# Altium project VE373.PrjPcb
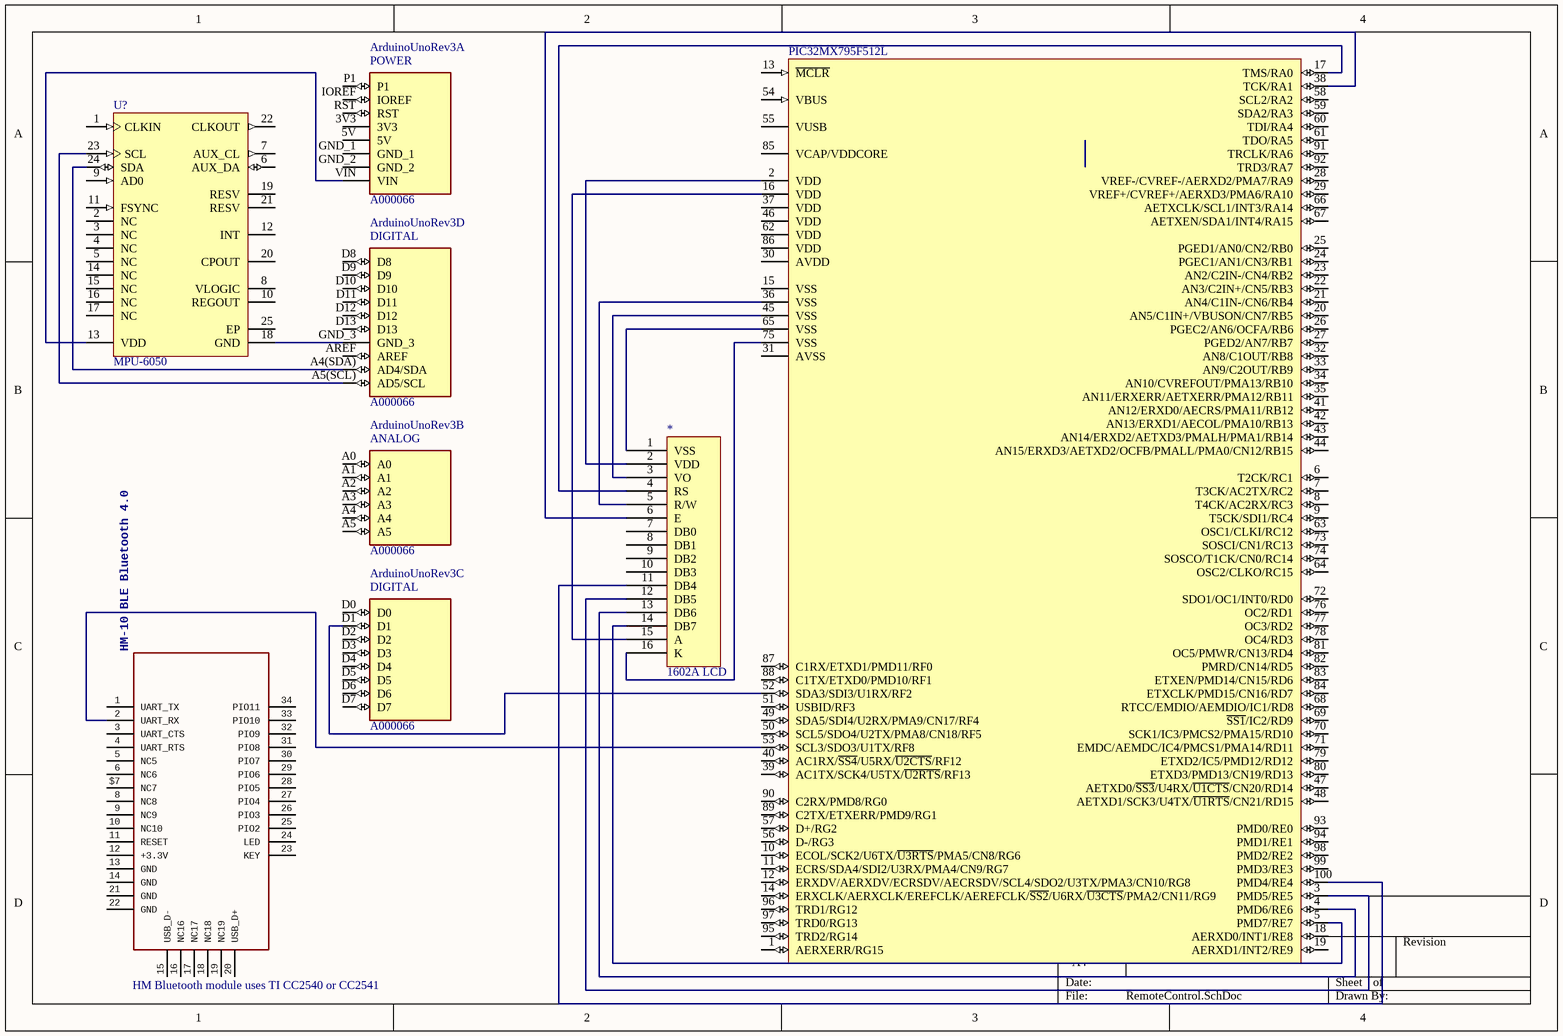
[diagram p0: RemoteControl.SchDoc]
1 sheet, 5 parts. Net scope: global (net labels, ports and power ports of the same name join across sheets).

## Sheet RemoteControl.SchDoc
size A4; SheetNumber: 1; SheetTotal: 1

### Parts
*  1602A LCD
ArduinoUnoRev3  A000066  [ARDUINO_A000066]  (parts A,B,C,D of 4)
HM-10_BLE_Bluetooth_4.0  HM Bluetooth module uses TI CC2540 or CC2541  [26.9X13X2.2_BOARD]
PIC32MX795F512L  PIC32MX795F512L-80I/PT  [TQFP-PT100_N]  (value not drawn)
U?  MPU-6050  [IS-QFN-24_V]

### Nets
Net*_1: *.1(VSS) PIC32MX795F512L.65(VSS)
Net*_2: *.2(VDD) PIC32MX795F512L.2(VDD)
Net*_3: *.3(VO) PIC32MX795F512L.45(VSS)
Net*_4: *.4(RS) PIC32MX795F512L.17(TMS/RA0)
Net*_5: *.5(R/W) PIC32MX795F512L.36(VSS)
Net*_6: *.6(E) PIC32MX795F512L.38(TCK/RA1)
Net*_11: *.11(DB4) PIC32MX795F512L.100(PMD4/RE4)
Net*_12: *.12(DB5) PIC32MX795F512L.3(PMD5/RE5)
Net*_13: *.13(DB6) PIC32MX795F512L.4(PMD6/RE6)
Net*_14: *.14(DB7) PIC32MX795F512L.5(PMD7/RE7)
Net*_15: *.15(A) PIC32MX795F512L.16(VDD)
Net*_16: *.16(K) PIC32MX795F512L.75(VSS)
NetArduinoUnoRev3_A4(SDA): ArduinoUnoRev3.A4(SDA)(AD4/SDA) U?.24(SDA)
NetArduinoUnoRev3_A5(SCL): ArduinoUnoRev3.A5(SCL)(AD5/SCL) U?.23(SCL)
NetArduinoUnoRev3_D1: ArduinoUnoRev3.D1 PIC32MX795F512L.52(SDA3/SDI3/U1RX/RF2)
NetArduinoUnoRev3_GND_3: ArduinoUnoRev3.GND_3 U?.18(GND)
NetArduinoUnoRev3_VIN: ArduinoUnoRev3.VIN U?.13(VDD)
NetHM-10_BLE_Bluetooth_4.0_2: HM-10_BLE_Bluetooth_4.0.2(UART_RX) PIC32MX795F512L.53(SCL3/SDO3/U1TX/RF8)

Not connected (* = marked no-connect by the designer): * 7(DB0) 8(DB1) 9(DB2) 10(DB3); ArduinoUnoRev3 3V3 5V A0 A1 A2 A3 A4 A5 AREF D0 D2 D3 D4 D5 D6 D7 D8 D9 D10 D11 D12 D13 GND_1 GND_2 IOREF P1 RST; HM-10_BLE_Bluetooth_4.0 1(UART_TX) 3(UART_CTS) 4(UART_RTS) 5(NC5) 6(NC6) 8(NC8) 9(NC9) 10(NC10) 11(RESET) 12(+3.3V) 13(GND) 14(GND) 15(USB_D-) 16(NC16) 17(NC17) 18(NC18) 19(NC19) 20(USB_D+) 21(GND) 22(GND) 23(KEY) 24(LED) 25(PIO2) 26(PIO3) 27(PIO4) 28(PIO5) 29(PIO6) 30(PIO7) 31(PIO8) 32(PIO9) 33(PIO10) 34(PIO11) $7(NC7); PIC32MX795F512L 1(AERXERR/RG15) 6(T2CK/RC1) 7(T3CK/AC2TX/RC2) 8(T4CK/AC2RX/RC3) 9(T5CK/SDI1/RC4) 10(ECOL/SCK2/U6TX/~{U3RTS}/PMA5/CN8/RG6) 11(ECRS/SDA4/SDI2/U3RX/PMA4/CN9/RG7) 12(ERXDV/AERXDV/ECRSDV/AECRSDV/SCL4/SDO2/U3TX/PMA3/CN10/RG8) 13(~{MCLR}) 14(ERXCLK/AERXCLK/EREFCLK/AEREFCLK/~{SS2}/U6RX/~{U3CTS}/PMA2/CN11/RG9) 15(VSS) 18(AERXD0/INT1/RE8) 19(AERXD1/INT2/RE9) 20(AN5/C1IN+/VBUSON/CN7/RB5) 21(AN4/C1IN-/CN6/RB4) 22(AN3/C2IN+/CN5/RB3) 23(AN2/C2IN-/CN4/RB2) 24(PGEC1/AN1/CN3/RB1) 25(PGED1/AN0/CN2/RB0) 26(PGEC2/AN6/OCFA/RB6) 27(PGED2/AN7/RB7) 28(VREF-/CVREF-/AERXD2/PMA7/RA9) 29(VREF+/CVREF+/AERXD3/PMA6/RA10) 30(AVDD) 31(AVSS) 32(AN8/C1OUT/RB8) 33(AN9/C2OUT/RB9) 34(AN10/CVREFOUT/PMA13/RB10) 35(AN11/ERXERR/AETXERR/PMA12/RB11) 37(VDD) 39(AC1TX/SCK4/U5TX/~{U2RTS}/RF13) 40(AC1RX/~{SS4}/U5RX/~{U2CTS}/RF12) 41(AN12/ERXD0/AECRS/PMA11/RB12) 42(AN13/ERXD1/AECOL/PMA10/RB13) 43(AN14/ERXD2/AETXD3/PMALH/PMA1/RB14) 44(AN15/ERXD3/AETXD2/OCFB/PMALL/PMA0/CN12/RB15) 46(VDD) 47(AETXD0/~{SS3}/U4RX/~{U1CTS}/CN20/RD14) 48(AETXD1/SCK3/U4TX/~{U1RTS}/CN21/RD15) 49(SDA5/SDI4/U2RX/PMA9/CN17/RF4) 50(SCL5/SDO4/U2TX/PMA8/CN18/RF5) 51(USBID/RF3) 54(VBUS) 55(VUSB) 56(D-/RG3) 57(D+/RG2) 58(SCL2/RA2) 59(SDA2/RA3) 60(TDI/RA4) 61(TDO/RA5) 62(VDD) 63(OSC1/CLKI/RC12) 64(OSC2/CLKO/RC15) 66(AETXCLK/SCL1/INT3/RA14) 67(AETXEN/SDA1/INT4/RA15) 68(RTCC/EMDIO/AEMDIO/IC1/RD8) 69(~{SS1}/IC2/RD9) 70(SCK1/IC3/PMCS2/PMA15/RD10) 71(EMDC/AEMDC/IC4/PMCS1/PMA14/RD11) 72(SDO1/OC1/INT0/RD0) 73(SOSCI/CN1/RC13) 74(SOSCO/T1CK/CN0/RC14) 76(OC2/RD1) 77(OC3/RD2) 78(OC4/RD3) 79(ETXD2/IC5/PMD12/RD12) 80(ETXD3/PMD13/CN19/RD13) 81(OC5/PMWR/CN13/RD4) 82(PMRD/CN14/RD5) 83(ETXEN/PMD14/CN15/RD6) 84(ETXCLK/PMD15/CN16/RD7) 85(VCAP/VDDCORE) 86(VDD) 87(C1RX/ETXD1/PMD11/RF0) 88(C1TX/ETXD0/PMD10/RF1) 89(C2TX/ETXERR/PMD9/RG1) 90(C2RX/PMD8/RG0) 91(TRCLK/RA6) 92(TRD3/RA7) 93(PMD0/RE0) 94(PMD1/RE1) 95(TRD2/RG14) 96(TRD1/RG12) 97(TRD0/RG13) 98(PMD2/RE2) 99(PMD3/RE3); U? 1(CLKIN) 2(NC) 3(NC) 4(NC) 5(NC) 6(AUX_DA) 7(AUX_CL) 8(VLOGIC) 9(AD0) 10(REGOUT) 11(FSYNC) 12(INT) 14(NC) 15(NC) 16(NC) 17(NC) 19(RESV) 20(CPOUT) 21(RESV) 22(CLKOUT) 25(EP)

### Notes on the sheet
- (in symbol A000066, part A) POWER
- (in symbol A000066, part B) ANALOG
- (in symbol A000066, part C) DIGITAL
- (in symbol A000066, part D) DIGITAL

### Library data of the parts
ArduinoUnoRev3 = A000066: Plated Through Hole Protoboard Arduino Mega Platform Evaluation Expansion Board; pin to pad: A4(SDA)>A4(SDA; MP: ARDUINO UNO REV3; Value: *; MF: Arduino; Package: None; Price: None; SnapEDA_Link: https://www.snapeda.com/parts/ARDUINO%20UNO%20REV3/Arduino/view-part/1128320/?ref=snap; Availability: In Stock; Check_prices: https://www.snapeda.com/parts/ARDUINO%20UNO%20REV3/Arduino/view-part/1128320/?ref=eda
HM-10_BLE_Bluetooth_4.0 = HM-10-BOARD
PIC32MX795F512L = CMP-0048-00041-2: High Performance 80 MHz MIPS-Based 32-Bit Flash Microcontroller with USB, CAN and Ethernet, 512KB Program Memory, 100-pin TQFP, Industrial Temperature; PackageVersion: revBB, Aug-2009; RevisionNote: Component URLs added. DatasheetVersion updated. Pin names updated.; DatasheetVersion: revG, May-2011; PackageDescription: 100-Lead Plastic Thin Quad Flatpack (PT) - 12x12x1mm Body, 2.00mm [TQFP]; ComponentLink3Description: Microchip.com Home; ComponentLink3URL: http://www.microchip.com/; ComponentLink2Description: Packaging Specification; ComponentLink2URL: http://ww1.microchip.com/downloads/en/PackagingSpec/en012702.pdf; ComponentLink1URL: http://ww1.microchip.com/downloads/en/DeviceDoc/61156G.pdf; PackageReference: TQFP-PT100; ComponentLink1Description: Datasheet
U? = CMP-1753-00002-2: 3-Axis Gyroscope, Accelerometer and a Digital Motion Processor(TM) (DMP), 2.375 to 3.46 V, -40 to 85 degC, 24-Pin QFN, RoHS, Tape and Reel; Manufacturer: InvenSense; Featured Product: MPU-60506-Axis,IntegratedI²CSolution; Other Names: 1428-1007-2 / MPU6050; Sensor Type: MotionTracking; Online Catalog: MPU-6000™Series; Unit PriceUSD: Digital; Datasheet Version: Rev. 3.3, 05/2012; Category: Sensors,Transducers; Datasheet URL: http://datasheet.octopart.com/MPU-6050-InvenSense-datasheet-14421344.pdf; Family: Multifunction; Standard Package: 5,000; Manufacturer URL: http://www.invensense.com/; Output Type: Digital; Dynamic Catalog: MPU-6000™Series